# EAGLE design ArdNixie (EAGLE 7.5.0)
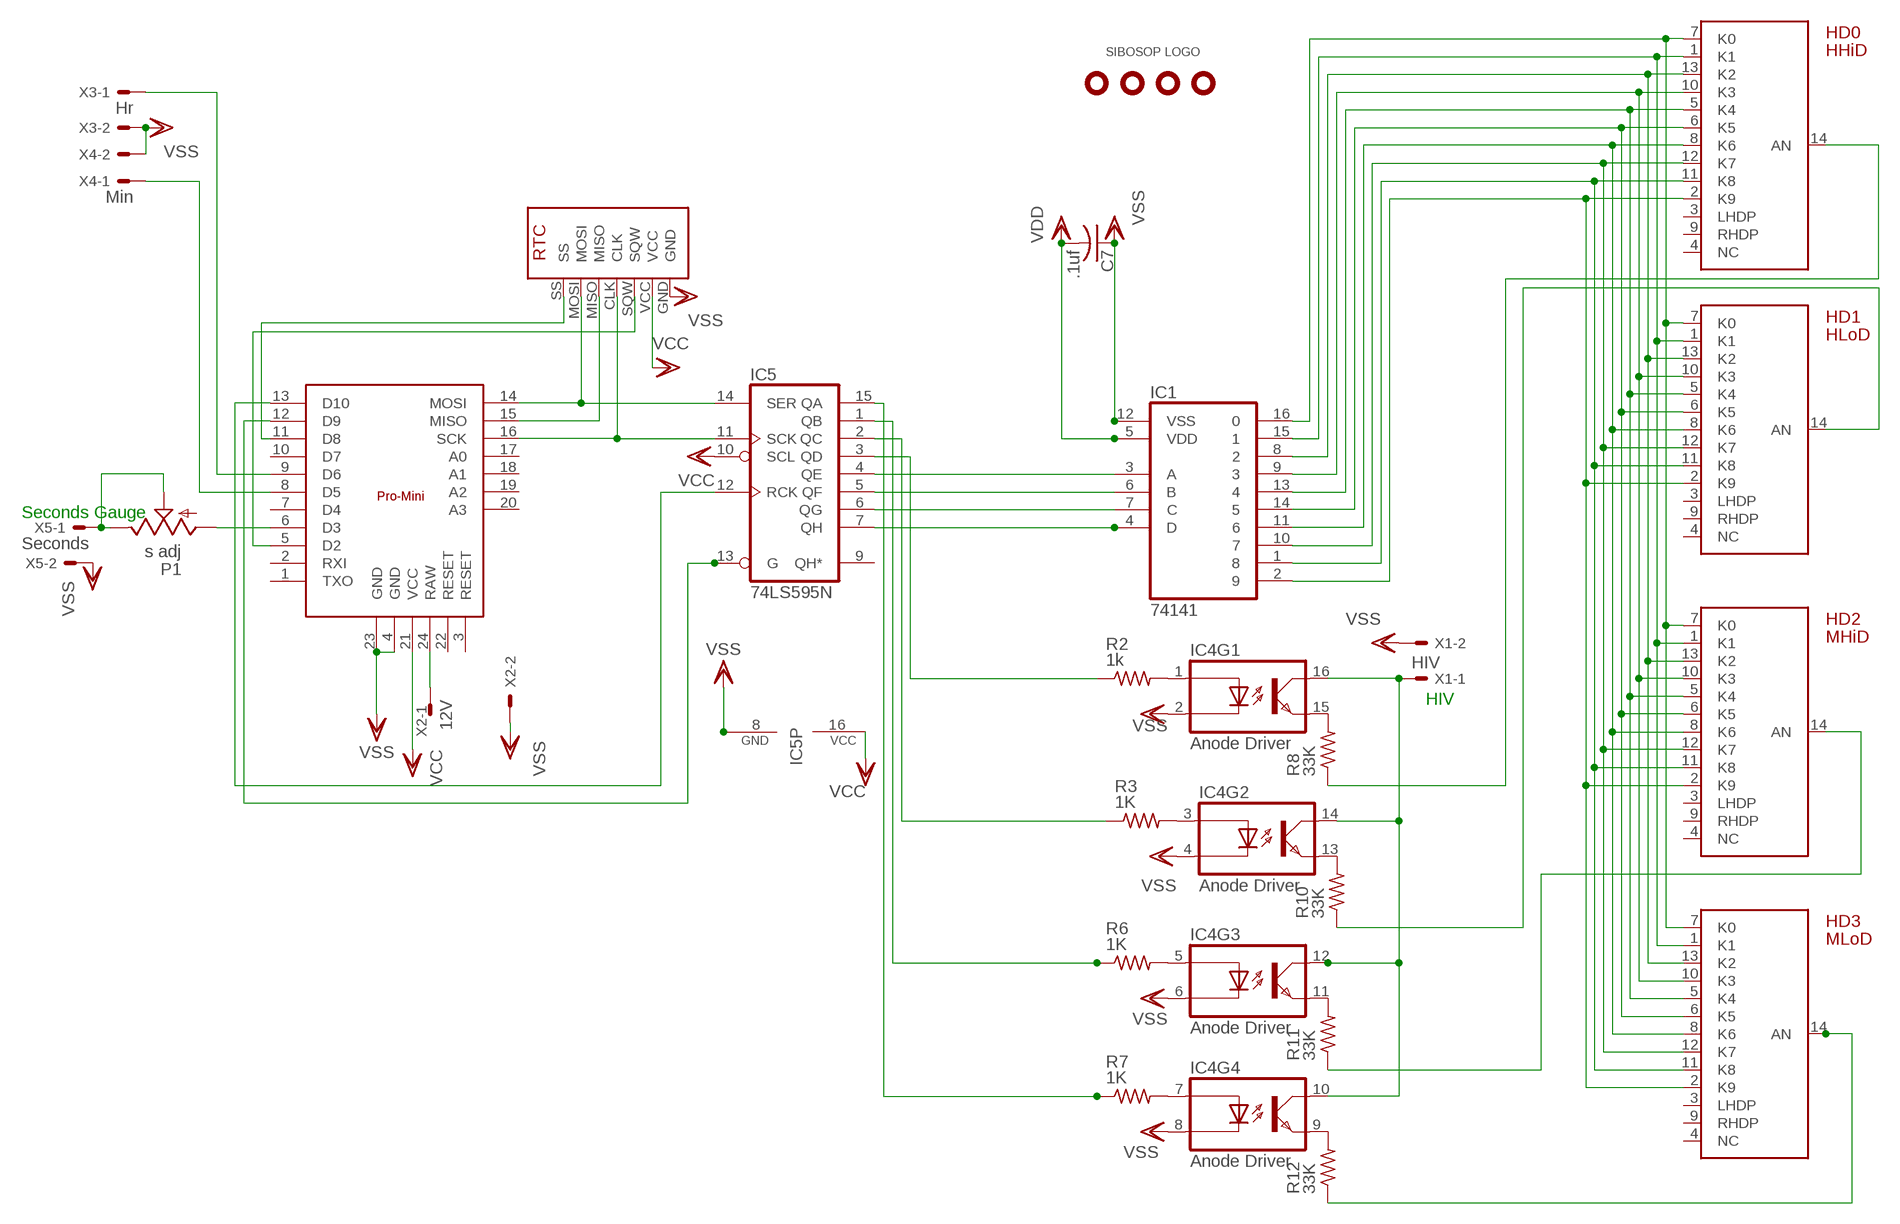
[diagram p0: schematic, sheet 1]

## Parts
C7  .1uf  C-US025-024X044  [C025-024X044]
HD0  HHiD  NIXIE-5440-HEADER  [DIL14]
HD1  HLoD  NIXIE-5440-HEADER  [DIL14]
HD2  MHiD  NIXIE-5440-HEADER  [DIL14]
HD3  MLoD  NIXIE-5440-HEADER  [DIL14]
IC1  74141  [DIP16]
IC2  PRO-MINI  [DIL24-6-EXT]
IC3  SPARKRTC  [SPARKRTC]
IC4  Anode Driver  TLP627  [DIP16]
IC5  74LS595N  [DIL16]
P1  s adj  TRIMPOT  [RJ6S]
R2  1k  R-US_0204/2V  [0204V]
R3  1K  R-US_0204/2V  [0204V]
R6  1K  R-US_0204/2V  [0204V]
R7  1K  R-US_0204/2V  [0204V]
R8  33K  R-US_0204/2V  [0204V]
R10  33K  R-US_0204/2V  [0204V]
R11  33K  R-US_0204/2V  [0204V]
R12  33K  R-US_0204/2V  [0204V]
U$1  HOLE-125  [HOLE-125]
U$2  HOLE-125  [HOLE-125]
U$3  LOGO  [LOGO]
U$5  HOLE-125  [HOLE-125]
U$7  HOLE-125  [HOLE-125]
X1  HIV  22-23-2021  [22-23-2021]
X2  12V  22-23-2021  [22-23-2021]
X3  Hr  22-23-2021  [22-23-2021]
X4  Min  22-23-2021  [22-23-2021]
X5  Seconds  22-23-2021  [22-23-2021]

## Nets
N$1: IC5.15(QA) R7.1
N$2: IC5.1(QB) R6.1
N$3: IC5.2(QC) R3.1
N$4: IC5.3(QD) R2.1
N$5: IC1.3(A) IC5.4(QE)
N$6: IC1.6(B) IC5.5(QF)
N$7: HD0.7(K0) HD1.7(K0) HD2.7(K0) HD3.7(K0) IC1.16
N$8: HD0.1(K1) HD1.1(K1) HD2.1(K1) HD3.1(K1) IC1.15
N$9: HD0.13(K2) HD1.13(K2) HD2.13(K2) HD3.13(K2) IC1.8
N$10: HD0.10(K3) HD1.10(K3) HD2.10(K3) HD3.10(K3) IC1.9
N$11: HD0.5(K4) HD1.5(K4) HD2.5(K4) HD3.5(K4) IC1.13
N$12: P1.E P1.S X5.1
N$13: HD0.8(K6) HD1.8(K6) HD2.8(K6) HD3.8(K6) IC1.11
N$14: HD0.12(K7) HD1.12(K7) HD2.12(K7) HD3.12(K7) IC1.10
N$15: HD0.11(K8) HD1.11(K8) HD2.11(K8) HD3.11(K8) IC1.1
N$16: HD0.2(K9) HD1.2(K9) HD2.2(K9) HD3.2(K9) IC1.2
N$17: IC1.7(C) IC5.6(QG)
N$18: IC1.4(D) IC5.7(QH)
N$19: IC2.24(RAW) X2.1
N$20: IC2.11(D8) IC3.SS
N$21: HD0.6(K5) HD1.6(K5) HD2.6(K5) HD3.6(K5) IC1.14
N$22: IC2.16(SCK) IC3.CLK IC5.11(SCK)
N$23: IC2.15(MISO) IC3.MISO
N$24: IC4.1(AN) R2.2
N$25: IC4.5(AN) R6.2
N$26: IC4.7(AN) R7.2
N$27: IC2.14(MOSI) IC3.MOSI IC5.14(SER)
N$28: IC2.5(D2) IC3.SQW
N$29: IC2.12(D9) IC5.13(G)
N$30: IC2.13(D10) IC5.12(RCK)
N$31: IC2.6(D3) P1.A
N$33: IC4.3(AN) R3.2
N$34: IC2.8(D5) X4.1
N$35: IC4.15(EM) R8.2
N$36: IC4.13(EM) R10.2
N$37: IC4.11(EM) R11.2
N$38: IC4.9(EM) R12.2
N$39: HD0.14(AN) R8.1
N$40: HD1.14(AN) R10.1
N$41: HD2.14(AN) R11.1
N$42: HD3.14(AN) R12.1
N$43: IC2.9(D6) X3.1
N$61: IC4.10(CO) IC4.12(CO) IC4.14(CO) IC4.16(CO) X1.1
VDD: C7.2 IC1.5(VDD) IC2.21(VCC) IC3.VCC IC5.10(SCL) IC5.16(VCC) ; supply symbol labelled VCC
VSS: C7.1 IC1.12(VSS) IC2.4(GND) IC2.23(GND) IC3.GND IC4.2(CA) IC4.4(CA) IC4.6(CA) IC4.8(CA) IC5.8(GND) X1.2 X2.2 X3.2 X4.2 X5.2
Unconnected: HD0.3(LHDP) HD0.4(NC) HD0.9(RHDP) HD1.3(LHDP) HD1.4(NC) HD1.9(RHDP) HD2.3(LHDP) HD2.4(NC) HD2.9(RHDP) HD3.3(LHDP) HD3.4(NC) HD3.9(RHDP) IC2.1(TXO) IC2.2(RXI) IC2.3(RESET) IC2.7(D4) IC2.10(D7) IC2.17(A0) IC2.18(A1) IC2.19(A2) IC2.20(A3) IC2.22(RESET) IC5.9(QH*)

## Notes on the sheet
- Seconds Gauge
- HIV

## Library data of the parts
C7 = rcl:C-US: CAPACITOR, American symbol
HD0 HD1-HD3 = sibosop:NIXIE-5440-HEADER: 14 pin dip header used to interface with a Nixie 5440 type tube
IC1 = sibosop:74141: Nixie BCD Decoder
IC2 = sibosop:PRO-MINI
IC3 = sibosop:SPARKRTC: spark fun deadon rtc breakout board
IC4 = sibosop:TLP627: Toshiba 4 unit photocoupler
IC5 = 74xx-us:74*595: 8-bit SHIFT REGISTER, output latch
P1 = sibosop:TRIMPOT
R2 R3 R6-R8 R10-R12 = rcl:R-US_: RESISTOR, American symbol
U$1 U$2 U$5 U$7 = sibosop:HOLE-125
U$3 = sibosop:LOGO
X1-X5 = sibosop-con-molex:22-23-2021: .100" (2.54mm) Center Header - 2 Pin

## Board
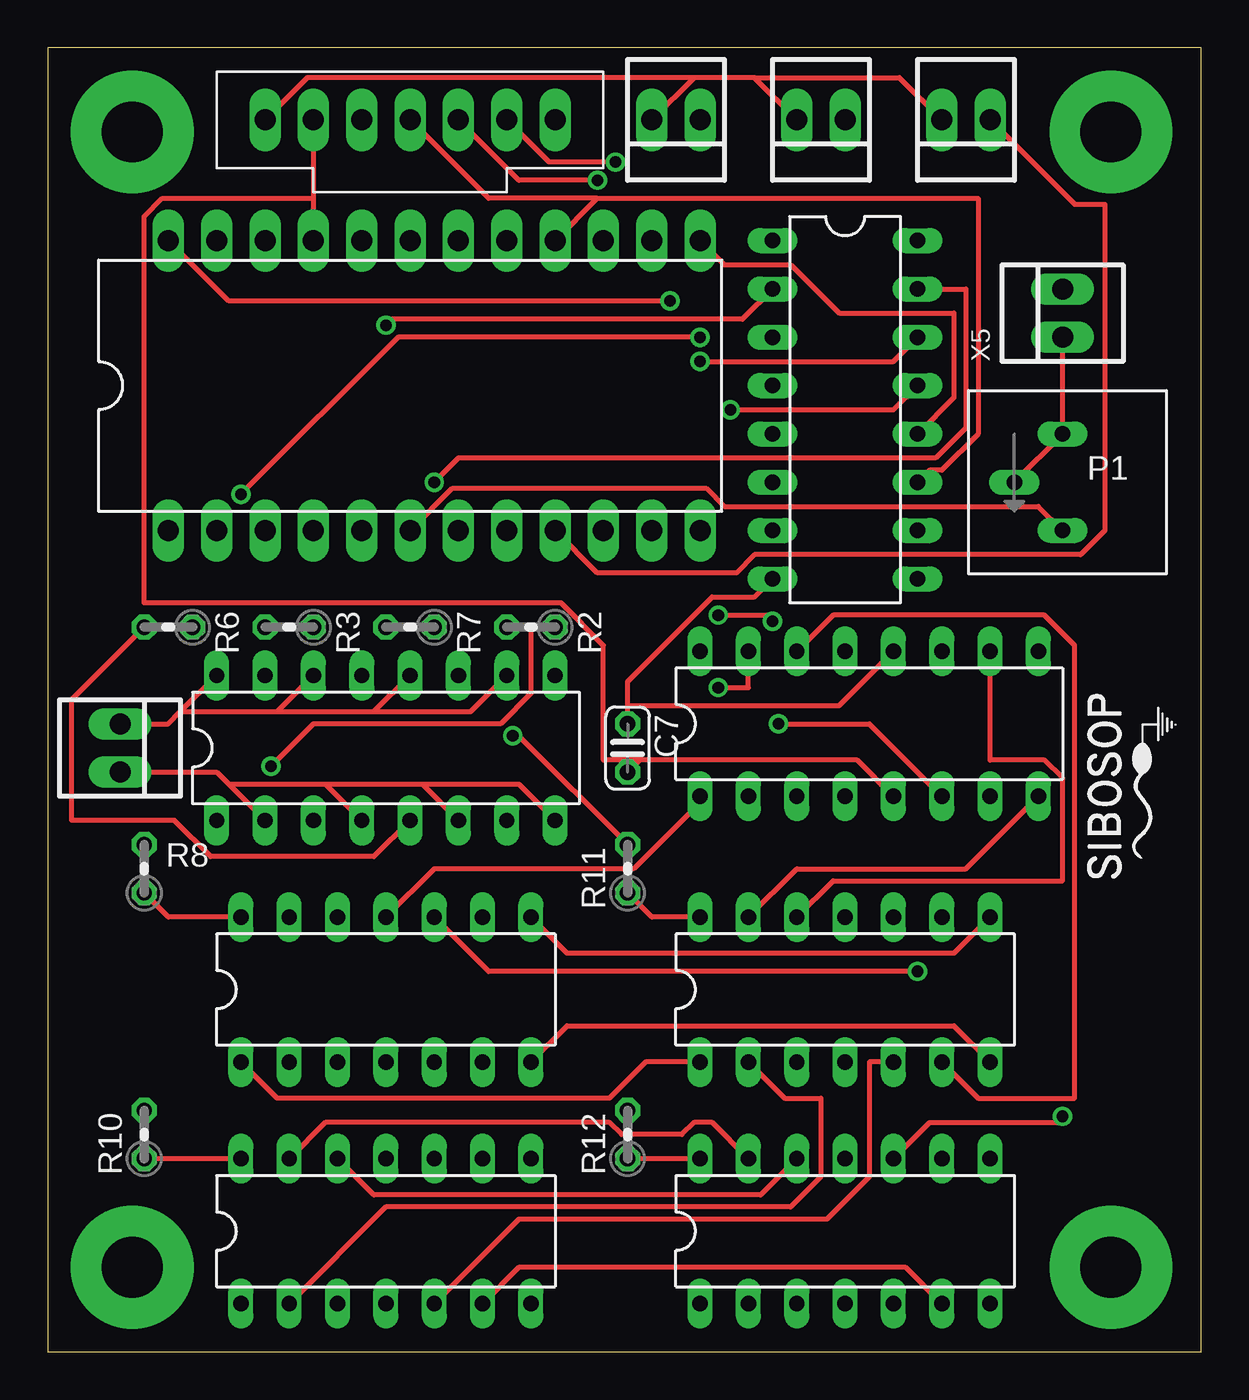
[diagram p1: board, top side]
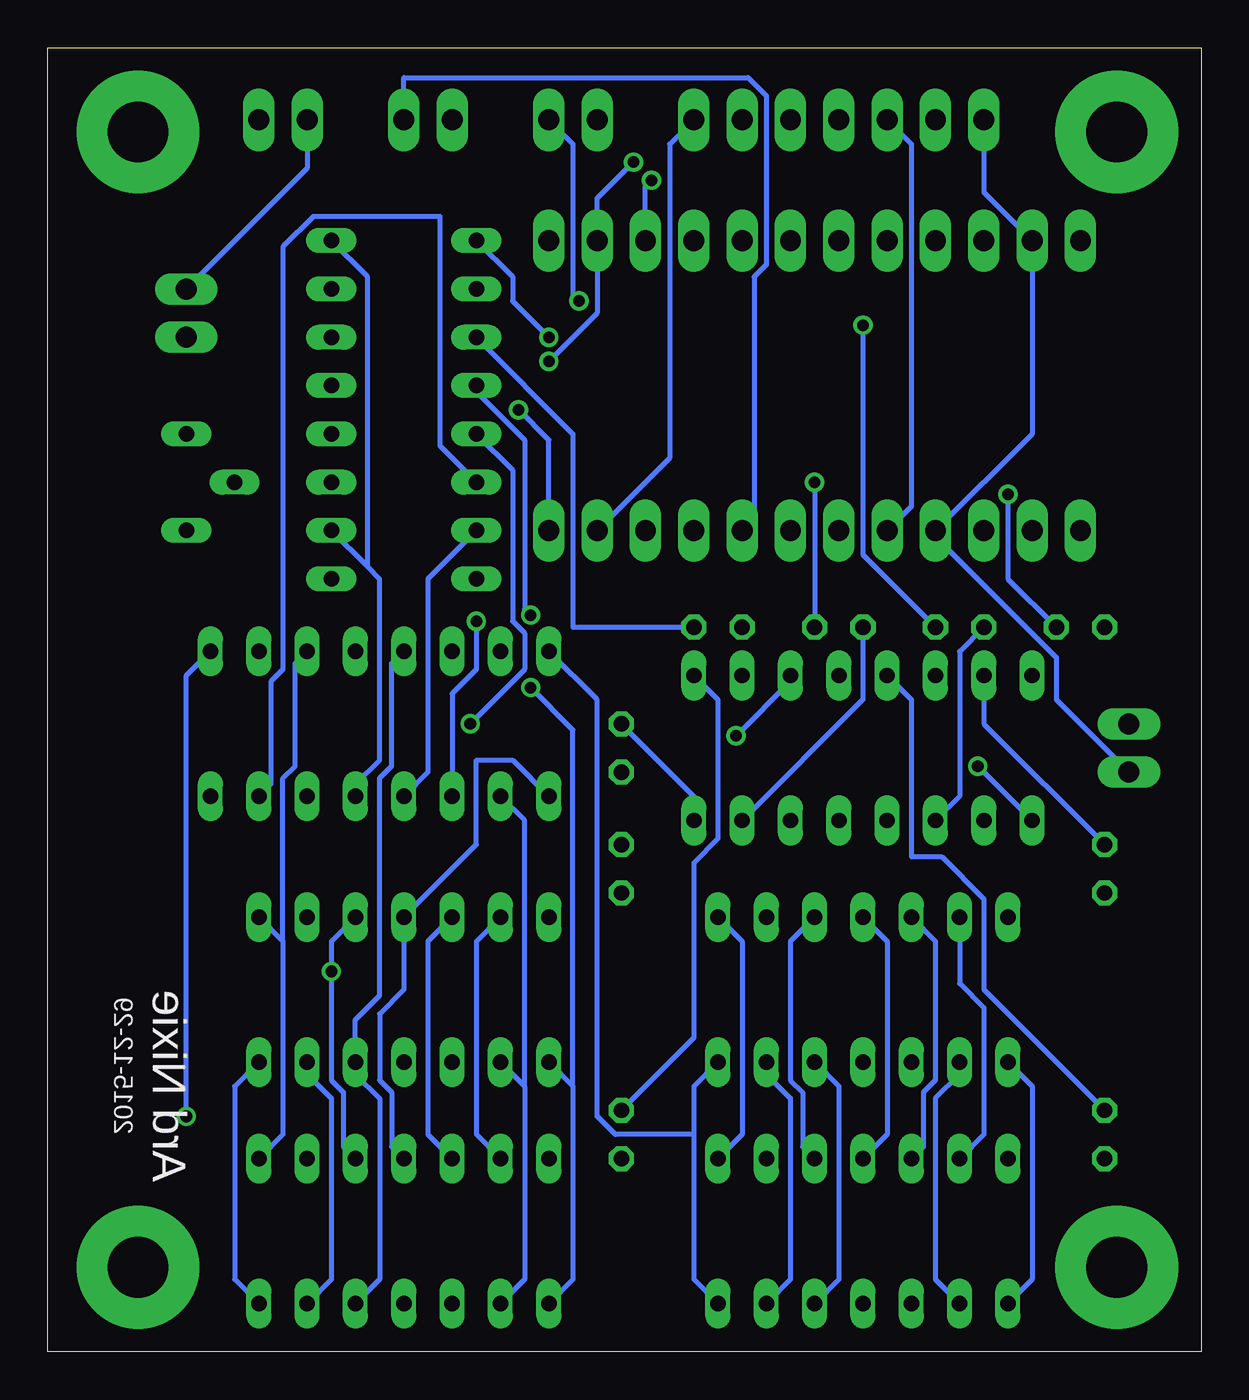
[diagram p2: board, bottom side, seen from below]

Size 60.63 x 68.57 mm. Coordinates in mm from the lower left corner, seen from the top.
Outline: 0,0 60.63,0 60.63,68.57 0,68.57 0,0
Copper layers (1*16): Top 0.035mm / dielectric 1.5mm / Bottom 0.035mm
Design rules "default": minimum track width 10mil, minimum drill 24mil, track to track 8mil, track to pad 8mil, pad to pad 8mil, via to via 8mil, smd to smd 8mil, copper to edge 40mil, drill to drill 8mil, minimum pad ring 10mil, minimum via ring 8mil, stop-mask expansion 4mil, vias tented up to drill 0mil, thermal gap 10mil

### Footprints (pad centres in the part's own frame; a part is rotated, then mirrored left to right if it is on the bottom)
C025-024X044 = drill 0.813 octagon: 1 -1.27,0; 2 1.27,0
DIL14 = drill 0.813 long: 1 -7.62,-3.81; 2 -5.08,-3.81; 3 -2.54,-3.81; 4 0,-3.81; 5 2.54,-3.81; 6 5.08,-3.81; 7 7.62,-3.81; 8 7.62,3.81; 9 5.08,3.81; 10 2.54,3.81; 11 0,3.81; 12 -2.54,3.81; 13 -5.08,3.81; 14 -7.62,3.81
DIP16 = drill 0.813 long: 1 -8.89,-3.81; 2 -6.35,-3.81; 3 -3.81,-3.81; 4 -1.27,-3.81; 5 1.27,-3.81; 6 3.81,-3.81; 7 6.35,-3.81; 8 8.89,-3.81; 9 8.89,3.81; 10 6.35,3.81; 11 3.81,3.81; 12 1.27,3.81; 13 -1.27,3.81; 14 -3.81,3.81; 15 -6.35,3.81; 16 -8.89,3.81
DIL24-6-EXT = drill 1.1 long: 1 -12.7,-7.62; 2 -10.16,-7.62; 3 -7.62,-7.62; 4 -5.08,-7.62; 5 -2.54,-7.62; 6 0,-7.62; 7 2.54,-7.62; 8 5.08,-7.62; 9 7.62,-7.62; 10 10.16,-7.62; 11 12.7,-7.62; 12 15.24,-7.62; 13 15.24,7.62; 14 12.7,7.62; 15 10.16,7.62; 16 7.62,7.62; 17 5.08,7.62; 18 2.54,7.62; 19 0,7.62; 20 -2.54,7.62; 21 -5.08,7.62; 22 -7.62,7.62; 23 -10.16,7.62; 24 -12.7,7.62
SPARKRTC = drill 1.1 long: CLK 0,0; GND 0,-7.62; MISO 0,2.54; MOSI 0,5.08; SQW 0,-2.54; SS 0,7.62; VCC 0,-5.08
DIL16 = drill 0.813 long: 1 -8.89,-3.81; 2 -6.35,-3.81; 3 -3.81,-3.81; 4 -1.27,-3.81; 5 1.27,-3.81; 6 3.81,-3.81; 7 6.35,-3.81; 8 8.89,-3.81; 9 8.89,3.81; 10 6.35,3.81; 11 3.81,3.81; 12 1.27,3.81; 13 -1.27,3.81; 14 -3.81,3.81; 15 -6.35,3.81; 16 -8.89,3.81
RJ6S = drill 0.813 long: A 2.54,0; E -2.54,0; S 0,-2.54
0204V = drill 0.813 octagon: 1 -1.27,0; 2 1.27,0
HOLE-125 = drill 3.2 pad 6.452: P$1 0,0
22-23-2021 = drill 1.1 long: 1 -1.27,0; 2 1.27,0

### Placement (x,y rotation side)
C7  30.48,31.75 270 top
HD0  17.78,19.05 0 top
HD1  17.78,6.35 0 top
HD2  41.91,19.05 0 top
HD3  41.91,6.35 0 top
IC1  43.18,33.02 0 top
IC2  19.05,50.8 0 top
IC3  19.05,64.77 270 top
IC4  17.78,31.75 0 top
IC5  41.91,49.53 270 top
P1  53.34,45.72 270 top
R2  25.4,38.1 180 top
R3  12.7,38.1 180 top
R6  6.35,38.1 180 top
R7  19.05,38.1 180 top
R8  5.08,25.4 90 top
R10  5.08,11.43 90 top
R11  30.48,25.4 90 top
R12  30.48,11.43 90 top
U$1  4.45,4.45 0 top
U$2  55.88,4.45 0 top
U$3  55.88,29.21 90 top
U$5  55.88,64.14 0 top
U$7  4.45,64.14 90 top
X1  3.81,31.75 270 top
X2  33.02,64.77 180 top
X3  48.26,64.77 180 top
X4  40.64,64.77 180 top
X5  53.34,54.61 90 top

### Tracks (layer width: path | path; a pad name or v marks a point on that pad's centre or on a via)
N$1  (via drill 0.61)
  Top 0.254: v20.32,45.72 21.59,46.99 46.67,46.99 48.26,48.58 48.26,55.88 IC5.15
  Bottom 0.254: v20.32,45.72 R7.1
N$2  (via drill 0.61)
  Top 0.254: v10.16,45.09 18.41,53.34 v34.29,53.34
  Bottom 0.254: R6.1 10.16,40.64 v10.16,45.09 | v34.29,53.34 36.2,55.24 36.2,56.52 IC5.1
N$3  (via drill 0.61)
  Top 0.254: v17.78,53.98 18.1,54.29 36.51,54.29 IC5.2
  Bottom 0.254: R3.1 17.78,41.91 v17.78,53.98
N$4
  Bottom 0.254: R2.1 33.02,38.1 33.02,48.26 IC5.3
N$5  (via drill 0.61)
  Top 0.254: v38.1,38.42 37.78,38.73 v35.24,38.73
  Bottom 0.254: IC1.3 39.37,34.61 38.1,35.88 v38.1,38.42 | v35.24,38.73 35.56,39.05 35.56,47.94 38.1,50.48 IC5.4
N$6  (via drill 0.61)
  Top 0.254: IC1.6 43.18,33.02 v38.42,33.02
  Bottom 0.254: v38.42,33.02 35.56,35.88 35.56,37.78 36.2,38.42 36.2,46.35 IC5.5
N$7
  Top 0.254: HD2.7 47.62,17.14 27.3,17.14 HD0.7
  Bottom 0.254: HD3.7 50.8,3.81 50.8,13.97 HD2.7 | HD1.7 26.67,3.81 26.67,11.43 | 26.67,11.43 26.67,13.97 HD0.7 | IC1.16 31.75,34.29 31.75,12.38 30.8,11.43 26.67,11.43
N$8  (via drill 0.61)
  Top 0.254: IC1.15 36.83,34.92 v35.24,34.92 | HD0.1 12.06,13.34 29.53,13.34 31.43,15.24 HD2.1
  Bottom 0.254: HD1.1 8.89,3.81 8.89,13.97 HD0.1 | HD3.1 33.02,3.81 33.02,13.97 | HD2.1 33.02,13.97 | v35.24,34.92 33.02,32.7 33.02,13.97
N$9
  Top 0.254: IC1.8 48.26,25.4 39.37,25.4 HD2.13 | HD1.13 14.61,12.06 29.53,12.06 30.16,11.43 33.34,11.43 33.97,12.06 34.92,12.06 HD3.13
  Bottom 0.254: HD1.13 11.43,11.43 11.43,18.1 12.7,19.37 HD0.13 | HD3.13 38.1,11.43 38.1,21.59 HD2.13
N$10  (via drill 0.61)
  Top 0.254: v53.34,12.38 53.02,12.06 46.35,12.06 HD3.10 | HD0.10 23.18,20 v45.72,20
  Bottom 0.254: HD1.10 20.95,10.79 20.95,13.65 21.59,14.29 21.59,21.59 HD0.10 | HD3.10 45.09,10.79 45.09,13.65 45.72,14.29 v45.72,20 45.72,21.59 HD2.10 | IC1.9 53.34,35.56 v53.34,12.38
N$11
  Top 0.254: HD1.5 24.77,6.99 40.96,6.99 43.18,9.21 43.18,15.24 HD2.5
  Bottom 0.254: HD1.5 19.05,3.81 19.05,13.97 HD0.5 | HD3.5 43.18,3.81 43.18,13.34 44.45,14.61 HD2.5 44.45,17.46 43.18,18.73 43.18,30.16 42.55,30.8 42.55,36.2 IC1.13
N$12
  Top 0.254: P1.S P1.E X5.1
N$13
  Top 0.254: HD0.8 27.3,20.95 47.62,20.95 HD2.8
  Bottom 0.254: HD1.8 24.13,11.43 24.13,21.59 HD0.8 | HD3.8 48.26,11.43 48.26,21.59 | HD2.8 48.26,21.59 | IC1.11 47.62,36.2 47.62,30.8 48.26,30.16 48.26,21.59
N$14
  Top 0.254: IC1.10 49.53,31.11 52.39,31.11 53.34,30.16 53.34,24.77 41.27,24.77 HD2.12 | HD1.12 17.14,8.26 37.47,8.26 HD3.12
  Bottom 0.254: HD1.12 14.61,10.79 14.61,13.65 13.97,14.29 13.97,21.59 HD0.12 | HD3.12 40.64,11.43 40.64,21.59 HD2.12
N$15
  Top 0.254: HD0.11 20.32,25.4 30.8,25.4 34.29,28.89 IC1.1
  Bottom 0.254: HD1.11 16.51,11.43 16.51,21.59 HD0.11 | IC1.1 36.2,31.11 38.1,31.11 38.1,26.67 HD2.11 41.91,19.05 43.18,17.78 43.18,14.29 42.55,13.65 42.55,10.79 HD3.11
N$16
  Top 0.254: HD1.2 17.78,7.62 39.05,7.62 40.64,9.21 40.64,13.34 38.73,13.34 HD2.2
  Bottom 0.254: HD1.2 13.97,3.81 13.97,13.34 12.7,14.61 HD0.2 | HD3.2 35.56,3.81 35.56,13.97 | HD2.2 35.56,13.97 | IC1.2 35.56,27.94 35.56,13.97
N$17
  Bottom 0.254: IC1.7 48.9,29.84 48.9,35.24 48.26,35.88 48.26,58.1 46.67,59.69 40.01,59.69 40.01,47.62 IC5.6
N$18
  Bottom 0.254: IC1.4 40.64,30.48 40.64,40.64 IC5.7
N$19  (via drill 0.61)
  Top 0.254: IC2.24 9.53,55.24 v32.7,55.24
  Bottom 0.254: v32.7,55.24 33.02,55.56 33.02,63.5 X2.1
N$20
  Bottom 0.254: IC2.11 27.94,46.99 27.94,63.5 IC3.SS
N$21
  Top 0.254: IC1.14 41.27,38.73 52.39,38.73 53.98,37.15 53.98,13.34 48.9,13.34 HD2.6 | HD1.6 24.77,4.45 45.09,4.45 HD3.6
  Bottom 0.254: HD1.6 21.59,3.81 21.59,13.34 22.86,14.61 HD0.6 | HD3.6 45.72,3.81 45.72,13.34 46.99,14.61 HD2.6
N$22
  Top 0.254: IC5.11 46.35,46.35 46.99,46.35 48.9,48.26 48.9,60.64 28.89,60.64 | IC2.16 28.89,60.64 | IC3.CLK 23.18,60.64 28.89,60.64
N$23  (via drill 0.61)
  Top 0.254: IC3.MISO 24.77,61.59 v28.89,61.59
  Bottom 0.254: v28.89,61.59 29.21,61.28 IC2.15
N$24  (via drill 0.61)
  Top 0.254: v11.75,30.8 13.97,33.02 23.81,33.02 25.4,34.61 25.4,38.1 R2.2
  Bottom 0.254: v11.75,30.8 IC4.1
N$25
  Top 0.254: R6.2 1.27,34.29 1.27,27.94 6.67,27.94 8.57,26.04 17.14,26.04 IC4.5
N$26
  Bottom 0.254: IC4.7 17.78,34.29 R7.2
N$27  (via drill 0.61)
  Top 0.254: IC5.14 44.45,52.07 v34.29,52.07 | IC3.MOSI 26.35,62.55 v29.84,62.55
  Bottom 0.254: v34.29,52.07 31.75,54.61 IC2.14 31.75,60.64 v29.84,62.55
N$28
  Bottom 0.254: IC2.5 15.24,44.45 15.24,63.5 IC3.SQW
N$29  (via drill 0.61)
  Top 0.254: IC5.13 44.45,49.53 v35.88,49.53
  Bottom 0.254: v35.88,49.53 34.29,47.94 IC2.12
N$30
  Top 0.254: IC5.12 47.62,50.16 47.62,54.61 41.59,54.61 39.05,57.15 35.56,57.15 IC2.13
N$31
  Top 0.254: P1.A 52.07,44.45 35.56,44.45 34.61,45.4 21.27,45.4 IC2.6
N$33
  Bottom 0.254: IC4.3 12.7,29.21 12.7,36.83 R3.2
N$34
  Bottom 0.254: IC2.8 23.5,43.81 23.5,56.52 22.86,57.15 22.86,66.04 23.81,66.99 41.91,66.99 X4.1
N$35
  Bottom 0.254: R8.2 11.43,33.02 IC4.15
N$36
  Bottom 0.254: R10.2 11.43,19.05 11.43,23.81 13.65,26.04 15.24,26.04 15.24,34.29 IC4.13
N$37  (via drill 0.61)
  Top 0.254: R11.2 24.77,32.38 v24.45,32.38
  Bottom 0.254: v24.45,32.38 21.59,35.24 IC4.11
N$38
  Bottom 0.254: R12.2 26.67,16.51 26.67,25.72 25.4,26.99 25.4,34.29 IC4.9
N$39
  Top 0.254: R8.1 6.35,22.86 HD0.14
N$40
  Top 0.254: HD1.14 R10.1
N$41
  Top 0.254: R11.1 31.75,22.86 HD2.14
N$42
  Top 0.254: HD3.14 R12.1
N$43
  Top 0.254: IC2.9 28.89,40.96 36.2,40.96 37.15,41.91 54.29,41.91 55.56,43.18 55.56,60.33 53.98,60.33 X3.1
N$61
  Top 0.254: 6.99,33.66 6.35,33.02 X1.1 | 6.99,33.66 IC4.16 | 12.06,33.66 IC4.14 | 6.99,33.66 12.06,33.66 | 17.14,33.66 IC4.12 | 12.06,33.66 17.14,33.66 | IC4.10 22.23,33.66 17.14,33.66
VDD
  Top 0.254: IC3.VCC 13.97,60.64 | 13.97,60.64 IC2.21 | 31.11,31.11 C7.2 | 31.11,31.11 42.55,31.11 IC1.5 | 13.97,60.64 6.03,60.64 5.08,59.69 5.08,39.37 26.99,39.37 29.21,37.15 29.21,31.11 31.11,31.11
  Bottom 0.254: 43.81,41.27 43.18,40.64 43.18,31.11 44.45,29.84 IC1.5 | 43.81,41.27 IC5.10 | IC5.16 43.81,56.52 43.81,41.27
VSS
  Top 0.254: 9.53,29.84 8.89,30.48 X1.2 | 9.53,29.84 IC4.2 | 14.61,29.84 IC4.4 | 9.53,29.84 14.61,29.84 | 19.68,29.84 IC4.6 | 14.61,29.84 19.68,29.84 | IC4.8 24.77,29.84 19.68,29.84 | IC5.8 37.15,39.69 34.92,39.69 30.48,35.24 30.48,33.97 | C7.1 30.48,33.97 | IC1.12 41.59,33.97 30.48,33.97 | 33.97,66.99 X2.2 | 37.15,66.99 33.97,66.99 | X4.2 37.15,66.99 | X3.2 44.77,66.99 37.15,66.99 | IC3.GND 13.65,66.99 33.97,66.99
  Bottom 0.254: C7.1 26.67,29.21 IC4.8 | IC3.GND 11.43,60.96 IC2.23 8.89,48.26 IC2.4 13.97,42.86 7.62,36.51 7.62,34.29 X1.2 | X5.2 46.99,62.23 X3.2

### Text on the board
bNames: Ard Nixie | 2015-12-29